# EAGLE design STM_test_board_1 (EAGLE 9.6.2)
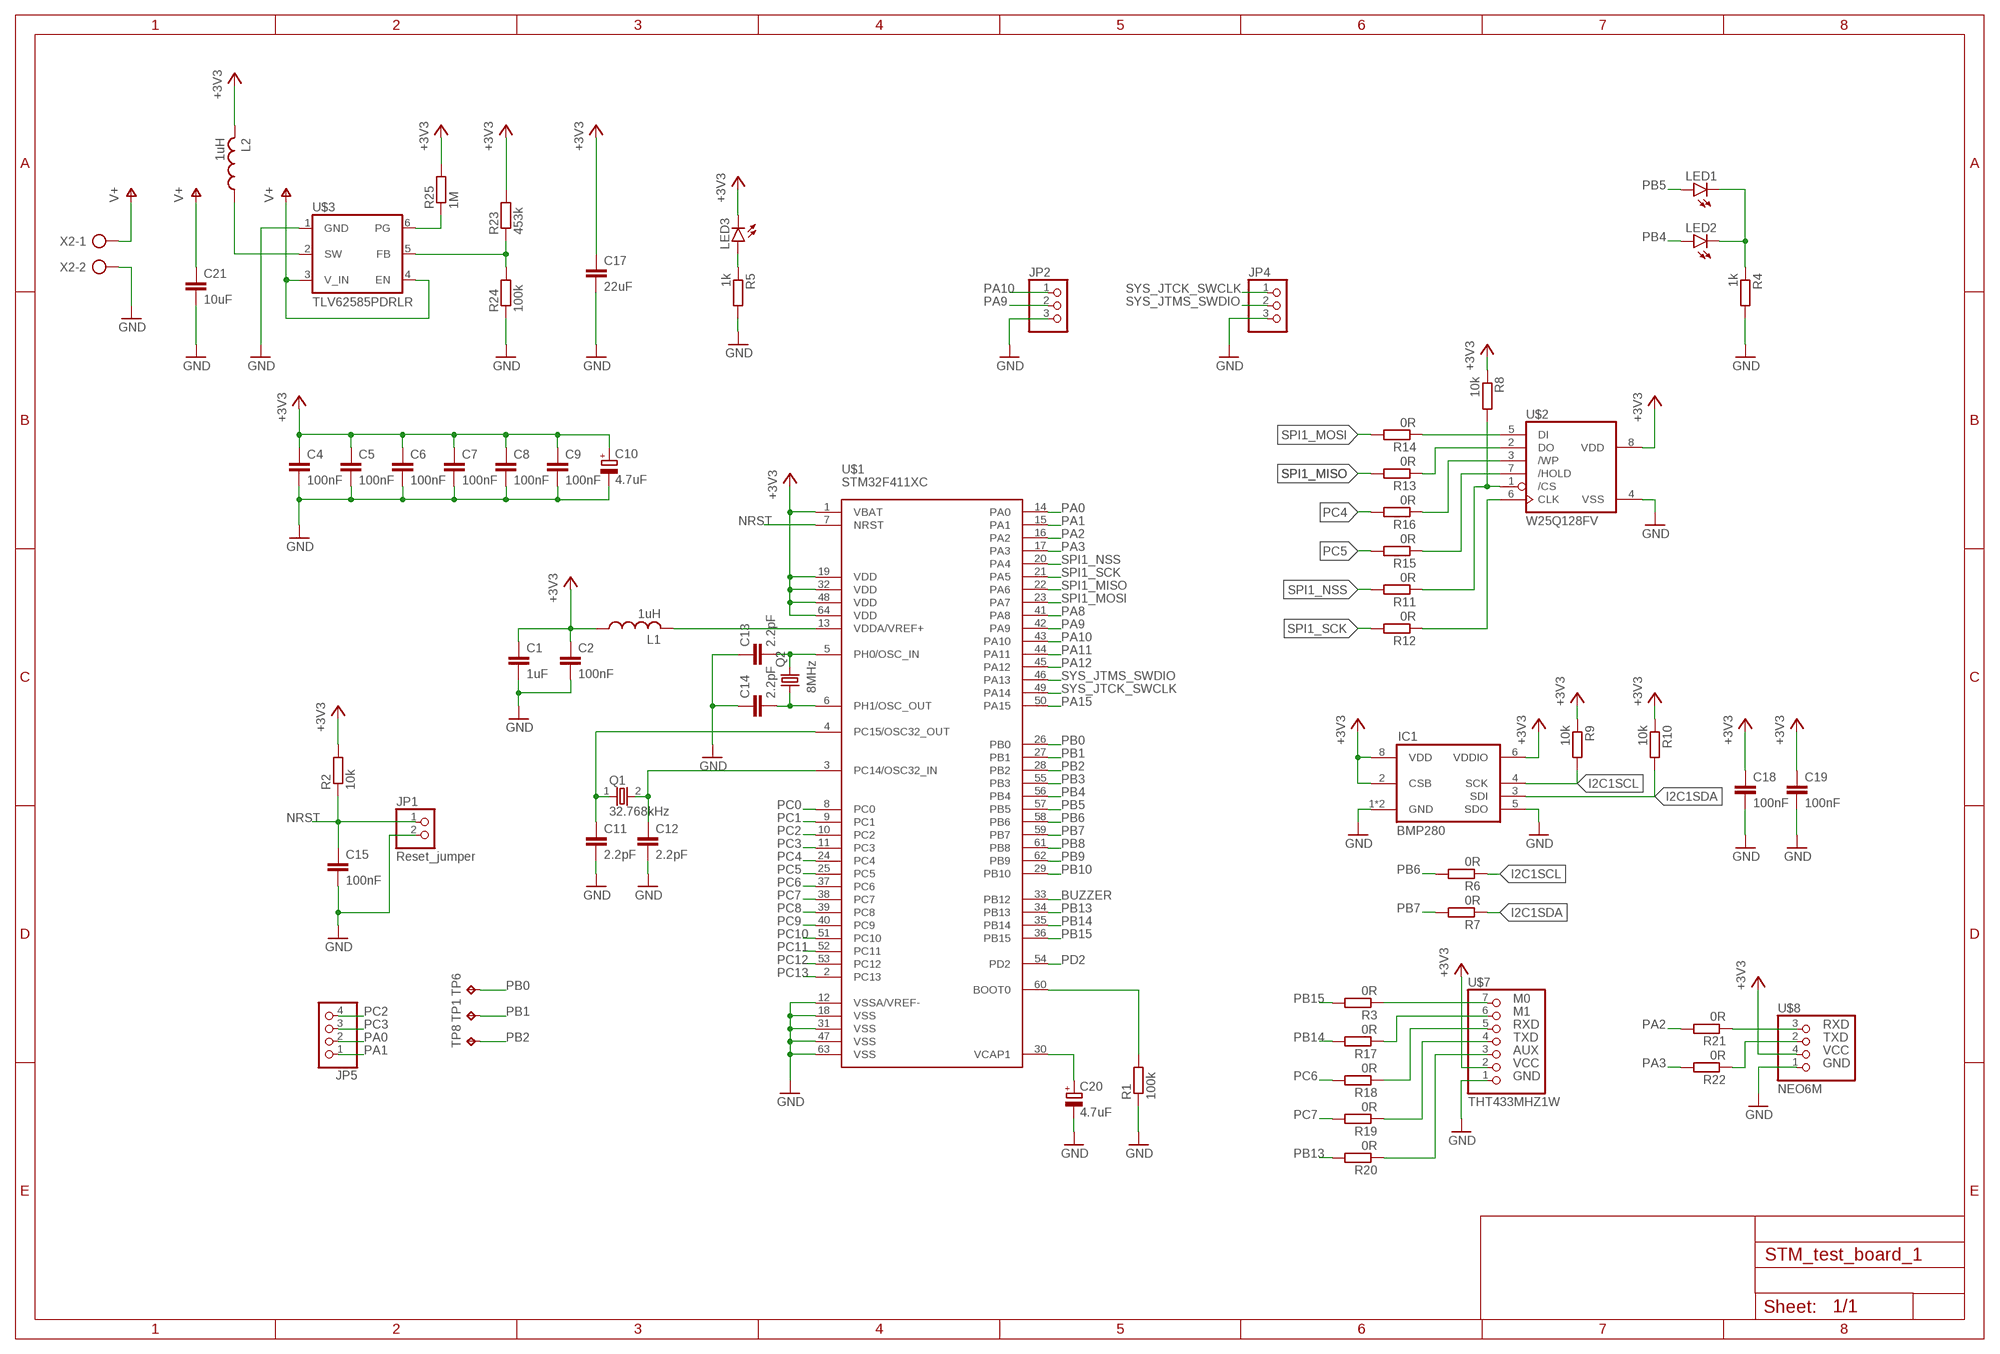
[diagram p0: schematic, sheet 1]

## Parts
C1  1uF  C-EUC1206  [C1206]
C2  100nF  C-EUC0805  [C0805]
C4  100nF  C-EUC0805  [C0805]
C5  100nF  C-EUC0805  [C0805]
C6  100nF  C-EUC0805  [C0805]
C7  100nF  C-EUC0805  [C0805]
C8  100nF  C-EUC0805  [C0805]
C9  100nF  C-EUC0805  [C0805]
C10  4.7uF  CPOL-EUCT3216  [CT3216]
C11  2.2pF  C-EUC0805  [C0805]
C12  2.2pF  C-EUC0805  [C0805]
C13  2.2pF  C-EUC0805  [C0805]
C14  2.2pF  C-EUC0805  [C0805]
C15  100nF  C-EUC0805  [C0805]
C17  22uF  C-EUC1206  [C1206]
C18  100nF  C-EUC0805  [C0805]
C19  100nF  C-EUC0805  [C0805]
C20  4.7uF  CPOL-EUCT3216  [CT3216]
C21  10uF  C-EUC0805  [C0805]
IC1  BMP280  [BMP280]
JP1  Reset_jumper  PINHD-1X2  [1X02]
JP2  PINHD-1X3M  [1X03M]
JP4  PINHD-1X3M  [1X03M]
JP5  PINHD-1X4M  [1X04M]
L1  1uH  L-US0207/7  [0207/7]
L2  1uH  L-USL5650M  [L5650M]
LED1  LEDSMT1206  [1206]
LED2  LEDSMT1206  [1206]
LED3  LEDSMT1206  [1206]
Q1  32.768kHz  MA507  [MA507]
Q2  8MHz  CRYSTALCTS406  [CTS406]
R1  100k  R-EU_R0805  [R0805]
R2  10k  R-EU_R0805  [R0805]
R3  0R  R-EU_R0805  [R0805]
R4  1k  R-EU_R0805  [R0805]
R5  1k  R-EU_R0805  [R0805]
R6  0R  R-EU_R0805  [R0805]
R7  0R  R-EU_R0805  [R0805]
R8  10k  R-EU_R0805  [R0805]
R9  10k  R-EU_R0805  [R0805]
R10  10k  R-EU_R0805  [R0805]
R11  0R  R-EU_R0805  [R0805]
R12  0R  R-EU_R0805  [R0805]
R13  0R  R-EU_R0805  [R0805]
R14  0R  R-EU_R0805  [R0805]
R15  0R  R-EU_R0805  [R0805]
R16  0R  R-EU_R0805  [R0805]
R17  0R  R-EU_R0805  [R0805]
R18  0R  R-EU_R0805  [R0805]
R19  0R  R-EU_R0805  [R0805]
R20  0R  R-EU_R0805  [R0805]
R21  0R  R-EU_R0805  [R0805]
R22  0R  R-EU_R0805  [R0805]
R23  453k  R-EU_R1206  [R1206]
R24  100k  R-EU_R0805  [R0805]
R25  1M  R-EU_R1206  [R1206]
TP1  TPTP20SQ  [TP20SQ]
TP6  TPTP20SQ  [TP20SQ]
TP8  TPTP20SQ  [TP20SQ]
U$1  STM32F411XC  [LQFP64]
U$2  W25Q128FV  [TSSOP-8]
U$3  TLV62585PDRLR  [SOT563]
U$7  THT433MHZ1W  [E32M1000]
U$8  NEO6M  [1X04]
X2  AK300/2  [AK300/2]

## Nets
+3V3: C1.1 C2.1 C4.1 C5.1 C6.1 C7.1 C8.1 C9.1 C10.+ C17.1 C18.1 C19.1 IC1.2(CSB) IC1.6(VDDIO) IC1.8(VDD) L1.1 L2.2 LED3.C R2.2 R8.1 R9.1 R10.1 R23.2 R25.2 U$1.1(VBAT) U$1.19(VDD) U$1.32(VDD) U$1.48(VDD) U$1.64(VDD) U$2.8(VDD) U$7.2(VCC) U$8.4(VCC)
BUZZER: U$1.33(PB12)
GND: C1.2 C2.2 C4.2 C5.2 C6.2 C7.2 C8.2 C9.2 C10.- C11.2 C12.2 C13.1 C14.1 C15.2 C17.2 C18.2 C19.2 C20.- C21.2 IC1.1(GND) IC1.5(SDO) IC1.7(GND) JP1.2 JP2.3 JP4.3 R1.1 R4.2 R5.2 R24.1 U$1.12(VSSA/VREF-) U$1.18(VSS) U$1.31(VSS) U$1.47(VSS) U$1.63(VSS) U$2.4(VSS) U$3.1(GND) U$7.1(GND) U$8.1(GND) X2.2
I2C1SCL: IC1.4(SCK) R6.1 R9.2
I2C1SDA: IC1.3(SDI) R7.1 R10.2
N$1: C13.2 Q2.3 U$1.5(PH0/OSC_IN)
N$2: C20.+ U$1.30(VCAP1)
N$3: C12.1 Q1.2 U$1.3(PC14/OSC32_IN)
N$4: C11.1 Q1.1 U$1.4(PC15/OSC32_OUT)
N$5: C14.2 Q2.1 U$1.6(PH1/OSC_OUT)
N$6: R1.2 U$1.60(BOOT0)
N$7: L1.2 U$1.13(VDDA/VREF+)
N$8: R14.1 U$2.5(DI)
N$9: R13.1 U$2.2(DO)
N$10: R12.1 U$2.6(CLK)
N$11: R16.1 U$2.3(/WP)
N$12: R15.1 U$2.7(/HOLD)
N$13: R3.1 U$7.7(M0)
N$14: R8.2 R11.1 U$2.1(/CS)
N$15: R17.1 U$7.6(M1)
N$16: R18.1 U$7.5(RXD)
N$17: R19.1 U$7.4(TXD)
N$18: R20.1 U$7.3(AUX)
N$19: R21.1 U$8.3(RXD)
N$20: LED1.C LED2.C R4.1
N$21: LED3.A R5.1
N$23: R22.1 U$8.2(TXD)
N$24: R23.1 R24.2 U$3.5(FB)
N$25: R25.1 U$3.6(PG)
N$26: L2.1 U$3.2(SW)
NRST: C15.1 JP1.1 R2.1 U$1.7(NRST)
PA0: JP5.2 U$1.14(PA0)
PA1: JP5.1 U$1.15(PA1)
PA2: R21.2 U$1.16(PA2)
PA3: R22.2 U$1.17(PA3)
PA8: U$1.41(PA8)
PA9: JP2.2 U$1.42(PA9)
PA10: JP2.1 U$1.43(PA10)
PA11: U$1.44(PA11)
PA12: U$1.45(PA12)
PA15: U$1.50(PA15)
PB0: TP6.TP U$1.26(PB0)
PB1: TP1.TP U$1.27(PB1)
PB2: TP8.TP U$1.28(PB2)
PB3: U$1.55(PB3)
PB4: LED2.A U$1.56(PB4)
PB5: LED1.A U$1.57(PB5)
PB6: R6.2 U$1.58(PB6)
PB7: R7.2 U$1.59(PB7)
PB8: U$1.61(PB8)
PB9: U$1.62(PB9)
PB10: U$1.29(PB10)
PB13: R20.2 U$1.34(PB13)
PB14: R17.2 U$1.35(PB14)
PB15: R3.2 U$1.36(PB15)
PC0: U$1.8(PC0)
PC1: U$1.9(PC1)
PC2: JP5.4 U$1.10(PC2)
PC3: JP5.3 U$1.11(PC3)
PC4: R16.2 U$1.24(PC4)
PC5: R15.2 U$1.25(PC5)
PC6: R18.2 U$1.37(PC6)
PC7: R19.2 U$1.38(PC7)
PC8: U$1.39(PC8)
PC9: U$1.40(PC9)
PC10: U$1.51(PC10)
PC11: U$1.52(PC11)
PC12: U$1.53(PC12)
PC13: U$1.2(PC13)
PD2: U$1.54(PD2)
SPI1_MISO: R13.2 U$1.22(PA6)
SPI1_MOSI: R14.2 U$1.23(PA7)
SPI1_NSS: R11.2 U$1.20(PA4)
SPI1_SCK: R12.2 U$1.21(PA5)
SYS_JTCK_SWCLK: JP4.1 U$1.49(PA14)
SYS_JTMS_SWDIO: JP4.2 U$1.46(PA13)
V+: C21.1 U$3.3(V_IN) U$3.4(EN) X2.1

## Library data of the parts
C1 C2 C4-C9 C11-C14 C18 C19 = rcl:C-EU: CAPACITOR, European symbol; SPICEPREFIX: C
C10 C20 = rcl:CPOL-EU: POLARIZED CAPACITOR, European symbol
C15 C17 C21 = rcl:C-EU: CAPACITOR, European symbol
IC1 = bosch-bmp280:BMP280: The BMP280 is an absolute barometric pressure sensor especially designed for mobile applications. The sensor module is housed in an extremely compact 8-pin metal-lid LGA package with a footprint of only 2.0 × 2.5 mm2 and 0.95 mm package height. Its small dimensions and its low power consumption of 2.7 μA @1Hz allow the implementation in battery driven devices such as mobile phones, GPS modules or watches. The library has been designed by Richard Magdycz <https://www.facebook.com/groups/eaglecadsoftUK>
JP1 = pinhead:PINHD-1X2: PIN HEADER
JP2 JP4 = pinhead:PINHD-1X3: PIN HEADER
JP5 = pinhead:PINHD-1X4: PIN HEADER
L1 L2 = rcl:L-US: INDUCTOR, American symbol
LED1-LED3 = led:LED: LED OSRAM: - CHIPLED LG R971, LG N971, LY N971, LG Q971, LY Q971, LO R971, LY R971 LH N974, LH R974 LS Q976, LO Q976, LY Q976 LO Q996 - Hyper CHIPLED LW Q18S LB Q993, LB Q99A, LB R99A - SideLED LS A670, LO A670, LY A670, LG A670, LP A670 LB A673, LV A673, LT A673, LW A673 LH A674 LY A675 LS A676, LA A676, LO A676, LY A676, LW A676 LS A679, LY A679, LG A679 - Hyper Micro SIDELED® LS Y876, LA Y876, LO Y876, LY Y876 LT Y87S - SmartLED LW L88C, LW L88S LB L89C, LB L89S, LG L890 LS L89K, LO L89K, LY L89K LS L896, LA L896, LO L896, LY L896 - TOPLED LS T670, LO T670, LY T670, LG T670, LP T670 LSG T670, LSP T670, LSY T670, LOP T670, LYG T670 LG T671, LOG T671, LSG T671 LB T673, LV T673, LT T673, LW T673 LH T674 LS T676, LA T676, LO T676, LY T676, LB T676, LH T676, LSB T676, LW T676 LB T67C, LV T67C, LT T67C, LS T67K, LO T67K, LY T67K, LW E67C LS E67B, LA E67B, LO E67B, LY E67B, LB E67C, LV E67C, LT E67C LW T67C LS T679, LY T679, LG T679 LS T770, LO T770, LY T770, LG T770, LP T770 LB T773, LV T773, LT T773, LW T773 LH T774 LS E675, LA E675, LY E675, LS T675 LS T776, LA T776, LO T776, LY T776, LB T776 LHGB T686 LT T68C, LB T68C - Hyper Mini TOPLED® LB M676 - Mini TOPLED Santana® LG M470 LS M47K, LO M47K, LY M47K Source: http://www.osram.convergy.de LUXEON: - LUMILED® LXK2-PW12-R00, LXK2-PW12-S00, LXK2-PW14-U00, LXK2-PW14-V00 LXK2-PM12-R00, LXK2-PM12-S00, LXK2-PM14-U00 LXK2-PE12-Q00, LXK2-PE12-R00, LXK2-PE12-S00, LXK2-PE14-T00, LXK2-PE14-U00 LXK2-PB12-K00, LXK2-PB12-L00, LXK2-PB12-M00, LXK2-PB14-N00, LXK2-PB14-P00, LXK2-PB14-Q00 LXK2-PR12-L00, LXK2-PR12-M00, LXK2-PR14-Q00, LXK2-PR14-R00 LXK2-PD12-Q00, LXK2-PD12-R00, LXK2-PD12-S00 LXK2-PH12-R00, LXK2-PH12-S00 LXK2-PL12-P00, LXK2-PL12-Q00, LXK2-PL12-R00 Source: www.luxeon.com KINGBRIGHT: KA-3528ASYC Source: www.kingbright.com
Q1 = crystal-epson:MA507
Q2 = crystal:CRYSTAL: CRYSTAL; OC_FARNELL: unknown; OC_NEWARK: unknown
R1-R25 = rcl:R-EU_: RESISTOR, European symbol
TP1 TP6 TP8 = testpad:TP: Test pad
U$1 = stm32f411:STM32F411XC
U$2 = smd-footprints:W25Q128FV
U$3 = LoRa:TLV62585PDRLR
U$7 = LoRa:THT433MHZ1W
U$8 = LoRa:NEO6M
X2 = con-ptr500:AK300/2: CONNECTOR; OC_FARNELL: unknown; OC_NEWARK: unknown

## Board
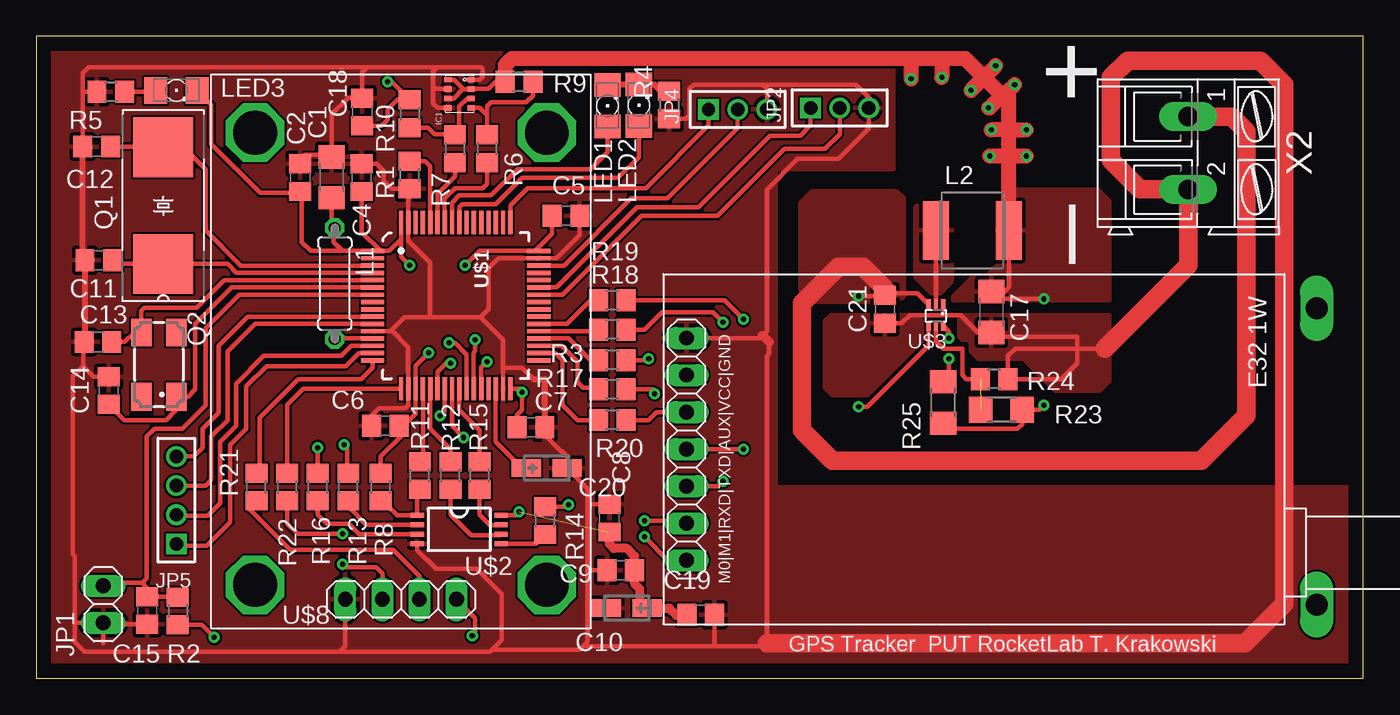
[diagram p1: board, top side]
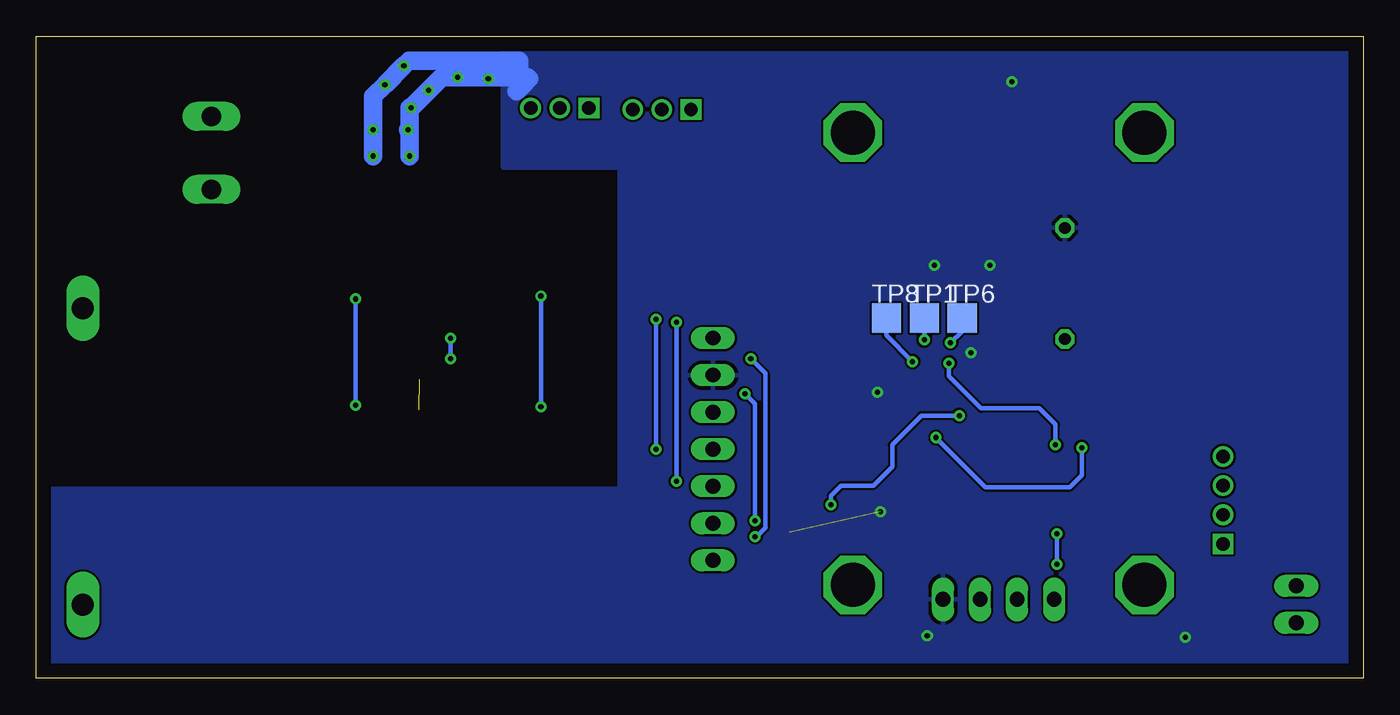
[diagram p2: board, bottom side, seen from below]

Size 91 x 44 mm. Coordinates in mm from the lower left corner, seen from the top.
Outline: 0,0 91,0 91,44 0,44 0,0
Copper layers (1*16): Top 0.035mm / dielectric 1.5mm / Bottom 0.035mm
Design rules "default": minimum track width 6mil, minimum drill 0.35mm, track to track 6mil, track to pad 6mil, pad to pad 6mil, via to via 6mil, smd to smd 6mil, copper to edge 40mil, drill to drill 6mil, minimum pad ring 10mil, minimum via ring 8mil, stop-mask expansion 4mil, vias tented up to drill 0mil, thermal gap 10mil

### Footprints (pad centres in the part's own frame; a part is rotated, then mirrored left to right if it is on the bottom)
C1206 = smd 1.6 x 1.8: 1 -1.4,0; 2 1.4,0
C0805 = smd 1.3 x 1.5: 1 -0.95,0; 2 0.95,0
CT3216 = smd 2 x 1.2: + -1.4,0; - 1.4,0
BMP280 = smd 0.35 x 0.5: 1 0.975,-0.8; 2 0.325,-0.8; 3 -0.325,-0.8; 4 -0.975,-0.8; 5 -0.975,0.8; 6 -0.325,0.8; 7 0.325,0.8; 8 0.975,0.8
1X02 = drill 1.016 long: 1 -1.27,0; 2 1.27,0
1X03M = drill 0.914 square: 1 -2,0 | drill 0.914: 2 0,0; 3 2,0
1X04M = drill 0.914 square: 1 -3,0 | drill 0.914: 2 -1,0; 3 1,0; 4 3,0
0207/7 = drill 0.813 octagon: 1 -3.81,0; 2 3.81,0
L5650M = smd 1.8 x 4: 1 -2.5,0; 2 2.5,0
1206 = smd 1.6 x 1.803: A -1.422,0; C 1.422,0
MA507 = smd 4.1 x 4.1: 1 -4,0; 2 4,0
CTS406 = smd 1.9 x 1.4: 1 -2.2,-1.2; 2 2.2,-1.2; 3 2.2,1.2; 4 -2.2,1.2
R0805 = smd 1.3 x 1.5: 1 -0.95,0; 2 0.95,0
R1206 = smd 1.6 x 1.803: 1 -1.422,0; 2 1.422,0
TP20SQ = smd 2 x 2: TP 0,0
LQFP64 = smd 0.3 x 1.6: 1 -3.75,-5.7; 2 -3.25,-5.7; 3 -2.75,-5.7; 4 -2.25,-5.7; 5 -1.75,-5.7; 6 -1.25,-5.7; 7 -0.75,-5.7; 8 -0.25,-5.7; 9 0.25,-5.7; 10 0.75,-5.7; 11 1.25,-5.7; 12 1.75,-5.7; 13 2.25,-5.7; 14 2.75,-5.7; 15 3.25,-5.7; 16 3.75,-5.7; 33 3.75,5.7; 34 3.25,5.7; 35 2.75,5.7; 36 2.25,5.7; 37 1.75,5.7; 38 1.25,5.7; 39 0.75,5.7; 40 0.25,5.7; 41 -0.25,5.7; 42 -0.75,5.7; 43 -1.25,5.7; 44 -1.75,5.7; 45 -2.25,5.7; 46 -2.75,5.7; 47 -3.25,5.7; 48 -3.75,5.7 | smd 1.6 x 0.3: 17 5.7,-3.75; 18 5.7,-3.25; 19 5.7,-2.75; 20 5.7,-2.25; 21 5.7,-1.75; 22 5.7,-1.25; 23 5.7,-0.75; 24 5.7,-0.25; 25 5.7,0.25; 26 5.7,0.75; 27 5.7,1.25; 28 5.7,1.75; 29 5.7,2.25; 30 5.7,2.75; 31 5.7,3.25; 32 5.7,3.75; 49 -5.7,3.75; 50 -5.7,3.25; 51 -5.7,2.75; 52 -5.7,2.25; 53 -5.7,1.75; 54 -5.7,1.25; 55 -5.7,0.75; 56 -5.7,0.25; 57 -5.7,-0.25; 58 -5.7,-0.75; 59 -5.7,-1.25; 60 -5.7,-1.75; 61 -5.7,-2.25; 62 -5.7,-2.75; 63 -5.7,-3.25; 64 -5.7,-3.75
TSSOP-8 = smd 0.9 x 0.35: 1 -2.875,0.975; 2 -2.875,0.325; 3 -2.875,-0.325; 4 -2.875,-0.975; 5 2.875,-0.975; 6 2.875,-0.325; 7 2.875,0.325; 8 2.875,0.975
SOT563 = smd 0.3 x 0.67: 1 -0.5,-0.74; 2 0,-0.74; 3 0.5,-0.74; 4 0.5,0.74; 5 0,0.74; 6 -0.5,0.74
E32M1000 = drill 1.016 long: 1 -7.62,0; 2 -5.08,0; 3 -2.54,0; 4 0,0; 5 2.54,0; 6 5.08,0; 7 7.62,0 | drill 1.5 long: P$1 -9.66,43.22; P$2 10.66,43.22
1X04 = drill 1.016 long: 1 -3.81,0; 2 -1.27,0; 3 1.27,0; 4 3.81,0 | drill 3 octagon: P$1 -10,1; P$2 10,1; P$3 -10,32; P$4 10,32
AK300/2 = drill 1.321 long: 1 -2.515,0; 2 2.489,0

### Placement (x,y rotation side)
C1  20.25,34.34 90 top
C2  18.1,34.32 90 top
C4  22.3,34.32 90 top
C5  36.32,31.7 0 top
C6  23.93,17.3 180 top
C7  33.92,17.2 0 top
C8  39.3,10.97 90 top
C9  40.08,7.4 180 top
C10  40.5,4.8 180 top
C11  4.28,28.65 180 top
C12  4.13,36.45 180 top
C13  4.22,23.05 0 top
C14  4.95,19.73 270 top
C15  7.6,4.63 270 top
C17  65.5,25.1 270 top
C18  22.35,38.82 90 top
C19  45.57,4.35 0 top
C20  35,14.4 0 top
C21  58.2,25.3 270 top
IC1  29.02,40.07 90 top
JP1  4.58,5.06 270 top
JP2  55.1,39.1 0 top
JP4  48.1,39 0 top
JP5  9.6,12.2 90 top
L1  20.46,27.06 270 top
L2  64.2,30.7 0 top
LED1  39.17,39.24 90 top
LED2  41.32,39.28 90 top
LED3  9.6,40.3 0 top
Q1  8.7,32.4 90 top
Q2  8.4,21.5 90 top
R1  25.6,34.5 90 top
R2  9.7,4.61 270 top
R3  39.5,21.8 180 top
R4  43.4,39.3 270 top
R5  5.1,40.2 180 top
R6  30.9,36.3 270 top
R7  28.7,36.3 270 top
R8  23.6,13.1 270 top
R9  33.1,40.9 0 top
R10  25.6,38.7 270 top
R11  26.3,13.9 90 top
R12  28.4,13.9 90 top
R13  21.4,13.1 90 top
R14  34.9,10.8 90 top
R15  30.4,13.9 90 top
R16  19.3,13.1 90 top
R17  39.5,19.8 180 top
R18  39.5,23.9 180 top
R19  39.5,25.9 180 top
R20  39.5,17.7 180 top
R21  15.1,13.1 90 top
R22  17.2,13.1 90 top
R23  66.2,18.4 0 top
R24  65.7,20.5 180 top
R25  62.2,18.9 270 top
TP1  30.1,24.7 0 bottom
TP6  27.5,24.7 0 bottom
TP8  32.7,24.7 0 bottom
U$1  28.76,25.54 270 top
U$2  29,10.2 0 top
U$3  61.7,24.9 180 top
U$7  44.6,15.7 270 top
U$8  25,5.4 0 top
X2  79,36 270 top

### Tracks (layer width: path | path; a pad name or v marks a point on that pad's centre or on a via)
+3V3  (via drill 0.35)  (1 unrouted)
  Top 0.305: U$1.48 34.19,29.29 | 34.19,29.29 30.39,29.29 v29.4,28.3 | U$1.64 25.01,30.1 | 25.01,30.1 25.01,28.89 v25.6,28.3 | 23.6,29.29 U$1.1 21.01,29.29 | 23.6,29.29 24.2,29.29 25.01,30.1 | 21.01,29.29 20.4,29.9 20.4,30.81 L1.1 20.25,31.08 C1.1 | C2.1 18.2,33.27 | 18.2,33.27 18.2,29.9 18.81,29.29 21.01,29.29 | 10.24,3.66 R2.2 11.34,3.66 v12.2,2.8 | C4.1 22.3,30.59 23.6,29.29 | C5.1 35.37,30.47 34.19,29.29 | 25,17.3 25.18,17.3 26.01,18.13 U$1.19 26.01,21.41 v26.9,22.3 | 25,17.3 C6.1 | 29.25,40.39 IC1.2 31,40.4 31.5,40.9 R9.1 | IC1.6 28.6,39.75 29.25,40.39 | 29.25,40.39 29.25,40.45 28.66,41.05 IC1.8 | C18.1 23.67,37.87 24.1,38.3 24.1,39 24.75,39.65 R10.1 24.35,40.9 v24.1,40.9 | U$1.32 33.16,19.84 33.3,19.7 v33.3,19.6 33.3,18.4 32.97,18.07 C7.1 | U$8.4 30.1,4.11 30.1,2.9 v29.9,2.9 | U$2.8 32.88,11.17 v33.1,11.4 | R8.1 23.6,15.2 25,16.6 25,17.3 | 18.2,33.27 15.33,33.27 12,36.6 12,39.32 LED3.C | C17.1 65.88,26.39 | 65.88,26.39 66.2,26.3 66.7,26.8 66.7,29.3 66.5,29.5 66.5,30.5 L2.2 | R25.2 62.58,17.1 67.3,17.1 67.62,17.42 R23.2 68.8,18.4 v69.1,18.7 | v69.1,26 66.27,26 65.88,26.39
  Top 0.406: C7.1 33.07,17.3
  Top 0.61: C8.1 39.3,9.2 39.6,8.9 40.5,8.9 41.03,8.37 C9.1 41.03,6.47 41.4,6.1 41.4,5.3 C10.+ 43.4,4.8 43.9,4.3 44.57,4.3 C19.1
  Top 1.016: L2.2 66.7,35.8 | 66.7,35.8 66.7,37.6 | 66.7,37.6 66.7,39.5 | 62.1,42.48 63.72,42.48 65,41.2 | 62.1,42.48 59.8,42.48 | 59.8,42.48 32.6,42.48 32.15,42.03 R9.1 | 66.7,39.5 66.25,39.95 | 66.25,39.95 65,41.2 | 59.8,42.48 60,42.28 v60,41.1 | 62.1,42.48 v62.1,41.2 | 65,41.2 v64.1,40.3 | 66.25,39.95 65.4,39.1 v65.3,39.1 | 65,41.2 v65.8,42 | 66.7,39.5 66.7,40.3 v67.1,40.7 | 66.7,37.6 v65.5,37.6 | 66.7,37.6 v67.9,37.6 | v67.9,35.8 66.7,35.8 | 66.7,35.8 v65.4,35.8
  Bottom 0.305: v69.1,18.7 v69.1,26
  Bottom 1.27: v65.4,35.8 65.4,37.5 v65.5,37.6 65.4,37.7 65.4,39.1 v65.3,39.1 v64.1,40.3 63.2,41.2 v62.1,41.2 58.4,41.2 | 58.4,41.2 57.3,41.2 57.2,41.1 57.7,40.6 57.72,40.6 58.06,40.26 | v67.9,35.8 v67.9,37.6 67.9,39.9 v67.1,40.7 v65.8,42 65.45,42.35 57.9,42.35 57.9,41.7 58.4,41.2
  pour Top: 63,25.9 73.6,25.9 73.6,32.7 72.8,33.5 66.7,33.5 65.9,32.7 65.9,28.3 65.2,27.6 64.3,27.6 63.5,26.8 62.9,26.2 62.9,25.9
  pour Bottom: 0,0 91,0 91,13 51,13 51,35 59,35 59,44 0,44
GND
  Top 0.305: U$1.12 24.29,23.79 24.35,23.85 | 24.35,23.85 25.25,24.75 27,24.75 | 24.35,23.85 25.51,22.69 U$1.18 25.51,18.71 25.3,18.5 23.5,18.5 22.98,17.98 C6.2 | 27,24.75 30.45,24.75 | U$1.31 32.01,21.3 | 32.01,21.3 32.01,23.19 30.45,24.75 | 30.45,24.75 31,25.3 31,28.1 31.69,28.79 U$1.47 35.69,28.79 37.27,30.37 C5.2 | 27,24.75 27,28.5 25.51,29.99 U$1.63 25.51,33.46 R1.1 24.35,33.55 23.8,34.1 23.8,34.8 23.33,35.27 C4.2 | JP1.2 4.58,2.4 | 7.42,3.5 C15.2 7.58,3.7 5.8,3.7 5.71,3.79 JP1.2 | 32.01,21.3 33.3,21.3 34.03,20.57 | JP1.2 2.61,3.79 | 2.61,3.79 2.61,8.39 2.5,8.5 2.5,20.7 3.2,21.4 | 2.61,3.79 2.61,2.49 3.3,1.8 20.8,1.8 | 18.06,35.23 C2.2 18.1,35.6 18.4,35.9 20.09,35.9 C1.2 20.25,38.65 21.4,39.8 22.32,39.8 C18.2 22.35,41.55 22.7,41.9 | C7.2 34.87,16.7 36.03,15.53 36.05,15.55 36.4,15.2 C20.- 37.8,13 37.8,12 | IC1.1 30.45,41.05 30.6,41.2 30.6,41.8 30.5,41.9 27.5,41.9 | 27.5,41.9 27.2,41.6 27.2,40.6 | 27.2,40.6 27.4,40.4 IC1.7 | IC1.5 27.51,39.09 27.2,39.4 27.2,40.6 | 22.7,41.9 27.5,41.9 | 43.58,38.17 R4.2 44.55,38.35 44.8,38.6 44.8,40.4 45.1,40.7 49.8,40.7 | U$7.1 49.62,23.32 49.8,23.5 50.1,23.8 50.1,33.5 52.2,35.6 55,35.6 57.1,37.7 JP2.3 57.2,39.2 57.2,39.7 56.2,40.7 49.8,40.7 | U$8.1 21.19,2.19 20.8,1.8 | C12.2 3.18,40.2 | 3.18,40.2 3.18,41.48 3.6,41.9 22.7,41.9 | U$2.4 26.12,8.77 27.4,7.5 30.2,7.5 31.9,5.8 31.9,2.6 31.25,1.95 | 31.25,1.95 31.1,1.8 20.8,1.8 | 31.25,1.95 37.25,1.95 37.5,2.2 | 37.5,2.2 37.8,2.5 37.8,4.8 | 37.8,4.8 37.8,7.4 | 37.8,7.4 37.8,12 | 37.5,2.2 46.6,2.2 | 46.6,2.2 50.1,2.2 50.1,2.4 50.1,22.1 50.25,22.25 50.25,23.05 | R5.2 3.18,40.2 | C10.- 37.8,4.8 | C19.2 46.52,2.28 46.6,2.2
  Top 0.305: C8.2 37.88,11.92 37.8,12 | C9.2 37.8,7.4 | C14.1 3.92,20.68 3.2,21.4 | 3.2,21.4 3.2,22.98 C13.1 | 49.8,40.7 50.1,40.4 JP4.3 | C21.2 59.35,24.35 59.9,24.9 62.2,24.9 | 62.2,24.9 63.4,24.9 64.6,23.7 C17.2 65.8,23.4 71.4,23.4 71.4,21.6 70.3,20.5 R24.1 66.65,22.1 67.15,22.6 73.3,22.6 | U$3.1 62.2,24.9
  Top 0.406: C13.1 3.3,23.08 3.3,28.62 C11.2 3.18,28.8 C12.2 | 34.03,20.57 34.1,20.5 34.87,20.5 C7.2
  Top 0.61: 49.8,23.5 50.25,23.05
  Top 1.27: 73.3,22.6 79,28.3 X2.2 75.69,33.51 73.7,35.5 73.7,41.2 74.85,42.35 83.95,42.35 85.6,40.7 85.6,5.1 82.9,2.4 50.1,2.4
  pour Top: 54.5,24.9 60.3,24.9 60.8,24.4 60.8,23.2 57,19.4 54.6,19.4 54.1,19.9 54.1,24.5
  pour Top: 63.32,24.9 73.6,24.9 73.6,20.4 72.9,19.7 69.9,19.7 67.7,21.9 64.6,21.9 64.1,22.4 64.1,23 63.9,23.2 63.5,23.2 63.3,23.4 63.3,24.5
  pour Top: 0,0 90.9,0 90.9,13.1 50.7,13.1 50.7,34.9 58.8,34.9 58.8,44 0,44
I2C1SCL
  Top 0.305: IC1.4 30.41,39.09 30.9,38.6 | R6.1 30.9,38.6 | 30.9,38.6 30.9,39.2 31.2,39.5 33.6,39.5 34.05,39.95 R9.2
I2C1SDA
  Top 0.305: IC1.3 29.55,39.75 29,39.2 29,37.55 28.83,37.38 28.75,37.3 | 28.75,37.3 R7.1 | R10.2 26.85,37.75 27.3,37.3 28.75,37.3
N$1
  Top 0.305: U$1.5 12.89,27.29 11,25.4 7.4,25.4 7.2,25.2 Q2.3 6.7,23.7 6.05,23.05 C13.2
N$2
  Top 0.305: U$1.30 31.51,18.29 31.5,18.28 31.5,16.2 33.3,14.4 C20.+
N$3
  Top 0.305: C12.1 8.65,36.45 Q1.2 10.1,36.4 11.6,34.9 11.6,30.7 14.01,28.29 U$1.3
N$4
  Top 0.305: U$1.4 13.71,27.79 13.1,28.4 Q1.1 5.48,28.4 C11.1
N$5
  Top 0.305: U$1.6 13.39,26.79 10.9,24.3 10.9,19.8 10.4,19.3 Q2.1 9.6,18.4 8.9,17.7 6.03,17.7 C14.2
N$6
  Top 0.305: R1.2 26.65,35.45 27.01,35.09 U$1.60
N$7
  Top 0.305: U$1.13 20.5,23.29 L1.2
N$8
  Top 0.305: U$2.5 34.27,9.23 R14.1
N$9
  Top 0.305: R13.1 21.4,11.75 22.62,10.52 U$2.2
N$10
  Top 0.305: R12.1 28.4,11.2 29.8,9.8 31.8,9.8 U$2.6
N$11
  Top 0.305: R16.1 19.3,11.2 19.9,10.6 21.4,10.6 22.12,9.88 U$2.3
N$12
  Top 0.305: R15.1 30.4,11.2 31.1,10.5 31.85,10.5 U$2.7
N$13  (via drill 0.35)
  Top 0.305: R3.1 41.9,21.8 v42,21.9 | v41.7,9.7 43.3,8.1 44.58,8.1 U$7.7
  Bottom 0.305: v42,21.9 41,20.9 41,10.3 41.6,9.7 v41.7,9.7
N$14
  Top 0.305: R8.2 23.75,12.15 24.73,11.17 U$2.1 26.12,12.77 R11.1
N$15  (via drill 0.35)
  Top 0.305: R17.1 42.3,19.8 42.5,19.6 v42.4,19.5 | v41.7,10.8 44.42,10.8 U$7.6
  Bottom 0.305: v42.4,19.5 41.7,18.8 v41.7,10.8
N$16  (via drill 0.35)
  Top 0.305: R18.1 41.7,23.9 42.9,25.1 46.4,25.1 v47.1,24.4 | v47.1,13.5 46.76,13.16 U$7.5
  Bottom 0.305: v47.1,24.4 v47.1,13.5
N$17  (via drill 0.35)
  Top 0.305: R19.1 47.2,25.9 v48.5,24.6 | v48.5,15.7 U$7.4
  Bottom 0.305: v48.5,24.6 v48.5,15.7
N$18
  Top 0.305: R20.1 42,17.7 42.54,18.24 U$7.3
N$19
  Top 0.305: R21.1 14.57,11.62 17.4,8.8 24.47,8.8 26.27,7 U$8.3
N$20
  Top 0.406: R4.1 42.85,40.25 42.4,40.7 LED2.C 39.21,40.7 LED1.C
N$21
  Top 0.305: R5.1 8.08,40.2 LED3.A
N$23  (via drill 0.35)
  Top 0.305: R22.1 17.2,10.6 17.9,9.9 v21,9.9 | v21,7.8 21.2,7.6 23.3,7.6 23.73,7.17 U$8.2
  Bottom 0.305: v21,9.9 v21,7.8
N$24  (1 unrouted)
  Top 0.305: U$3.5 61.7,23.1 62.2,22.6 63.5,22.6 63.5,20.8 63.8,20.5 R24.2
N$25  (via drill 0.35)
  Top 0.305: U$3.6 62.6,23.76 v62.6,23.3 | v62.6,21.9 62.6,20.72 R25.1
  Bottom 0.305: v62.6,23.3 v62.6,21.9
N$26
  Top 0.305: U$3.2 L2.1
  pour Top: 61.7,26.1 60.3,27.5 60.3,32.3 60.6,32.6 62.6,32.6 62.8,32.4 62.8,27.2
NRST
  Top 0.305: 7.25,6.53 4.78,6.53 JP1.1 | 7.25,6.53 7.6,6.18 C15.1 9.68,5.58 R2.1 9.7,5.9 | U$1.7 13.89,26.29 11.6,24 11.6,18.7 10,17.1 8.1,17.1 7.57,16.57 7.57,6.85 7.25,6.53
PA0
  Top 0.305: U$1.14 21.59,22.79 20.9,22.1 15.6,22.1 13.7,20.2 13.7,17.3 12.6,16.2 12.6,12 11.73,11.13 9.67,11.13 JP5.2
PA1
  Top 0.305: U$1.15 22.09,22.29 21.2,21.4 15.8,21.4 14.4,20 14.4,17.1 13.3,16 13.3,10.7 11.69,9.09 9.71,9.09 JP5.1
PA2
  Top 0.305: 22.49,21.79 U$1.16 23.06,21.29 22.26,20.49 17.94,20.49 15.3,17.85 15.3,14.25 R21.2
PA3
  Top 0.305: U$1.17 18.29,19.84 17.2,18.75 R22.2
PA9
  Top 0.305: U$1.42 36.09,26.29 41.5,31.7 46.7,31.7 51.3,36.3 54.1,36.3 55.1,37.3 JP2.2
PA10
  Top 0.305: U$1.43 35.69,26.79 41.2,32.3 45.4,32.3 50.3,37.2 52.4,37.2 53.1,37.9 JP2.1
PA11
  Top 0.305: U$1.44
PB0  (via drill 0.35)
  Top 0.305: U$1.26 29.51,22.19 28.7,23 v28.3,23
  Bottom 0.305: v28.3,23 27.5,23.8 TP6.TP
PB1  (via drill 0.35)
  Top 0.305: v30.1,23.2 30.1,22.4 30,22.3 U$1.27
  Bottom 0.305: TP1.TP v30.1,23.2
PB2  (via drill 0.35)
  Top 0.305: U$1.28 30.51,21.31 v30.9,21.7
  Bottom 0.305: v30.9,21.7 32.7,23.5 TP8.TP
PB4
  Top 0.305: U$1.56 29.01,32.31 29.2,32.5 31.5,32.5 33.3,34.3 39.9,34.3 41.32,35.72 LED2.A
PB5
  Top 0.305: 39.17,37.22 LED1.A 39.17,36.07 38,34.9 33,34.9 31.2,33.1 29,33.1 28.5,32.6 U$1.57
PB6
  Top 0.305: U$1.58 28.01,32.91 28.7,33.6 30.6,33.6 30.9,33.9 R6.2
PB7
  Top 0.305: U$1.59 27.51,33.21 28.7,34.4 R7.2
PB13
  Top 0.305: U$1.34 35.61,22.29 36.1,21.8 36.1,18.7 37.1,17.7 R20.2
PB14
  Top 0.305: U$1.35 36.01,22.79 37.1,21.7 37.1,20.3 37.5,19.9 38.45,19.9 R17.2 38.35,19.6
PB15
  Top 0.305: R3.2 38.45,21.7 38.1,21.7 36.51,23.29 U$1.36
PC0
  Top 0.305: U$1.8
PC1
  Top 0.305: U$1.9
PC2
  Top 0.305: U$1.10 14.49,24.79 12.5,22.8 12.5,18.21 11.4,17.11 11.4,15.8 10.8,15.2 JP5.4
PC3
  Top 0.305: U$1.11 14.99,24.29 13.1,22.4 13.1,17.7 12,16.6 12,13.6 11.6,13.2 JP5.3
PC4  (via drill 0.35)
  Top 0.305: U$1.24 28.51,17.29 v29.3,16.5 | v19.3,15.8 R16.2
  Bottom 0.305: v29.3,16.5 25.9,13.1 20.1,13.1 19.3,13.9 v19.3,15.8
PC5
  Top 0.305: R15.2 30.4,17 29,18.4 U$1.25
PC6
  Top 0.305: U$1.37 38.44,23.79 R18.2
PC7
  Top 0.305: U$1.38 36.39,24.29 38,25.9 R19.2
SPI1_MISO  (via drill 0.35)
  Top 0.305: R13.2 21.3,14.15 21.3,15.8 v21.1,16 | v28.4,21.6 28.1,21.6 27.5,21 U$1.22
  Bottom 0.305: v21.1,16 21.1,17.4 22.2,18.5 26.2,18.5 28.4,20.7 v28.4,21.6
SPI1_MOSI  (via drill 0.35)
  Top 0.305: U$1.23 28.01,18.31 v27.7,18 | v36.5,11.9 36.35,11.75 R14.2
  Bottom 0.305: v27.7,18 30.3,18 32.3,16 32.3,14.5 33.6,13.2 35.8,13.2 36.5,12.5 v36.5,11.9
SPI1_NSS
  Top 0.305: R11.2 26.51,15.06 U$1.20 26.51,15.09 26.6,15 26.6,15.3
SPI1_SCK
  Top 0.305: U$1.21 27.01,17.09 28.4,15.7 R12.2
SYS_JTCK_SWCLK
  Top 0.305: U$1.49 32.51,32.41 33.7,33.6 41.8,33.6 46.1,37.9 JP4.1
SYS_JTMS_SWDIO
  Top 0.305: U$1.46 36.19,28.29 40.8,32.9 43.3,32.9 48.1,37.7 JP4.2
V+  (via drill 0.35)
  Top 0.305: U$3.4 61.2,22.8 57,18.6 v56.4,18.6 | v56.4,26.2 58.15,26.2 C21.1 58.35,26.4 60.44,26.4 U$3.3
  Top 1.27: C21.1 58.2,26.7 56.7,28.2 55,28.2 52.5,25.7 52.5,17 54.6,14.9 79.9,14.9 83,18 83,37.5 82,38.5 79.02,38.5 X2.1
  Bottom 0.305: v56.4,18.6 v56.4,26.2
  pour Top: 53.2,25.8 59.1,25.8 59.5,26.2 59.5,32.9 59,33.4 53.2,33.4 52.4,32.6 52.4,26.6

### Text on the board
tPlace: + | _ | GPS Tracker PUT RocketLab T. Krakowski